# Altium schematic sheet muscle_prot.SchDoc
size A4; PageSetup: Record=PageOptions|CenterHorizontal=True|CenterVertical=True|PrintScale=3.08|XCorrection=1.00|YCorrection=1.00|PrintKind=0|BorderSize=5000000|LeftOffset=0|BottomOffset=0|Orientation=2|PaperLength=1000|PaperWidth=1000|Scale=100|PaperSource=7|PrintQuality=-4|MediaType=1|DitherType=10|PaperKind=A1 (594 x 841 мм)|PrintScaleMode=1
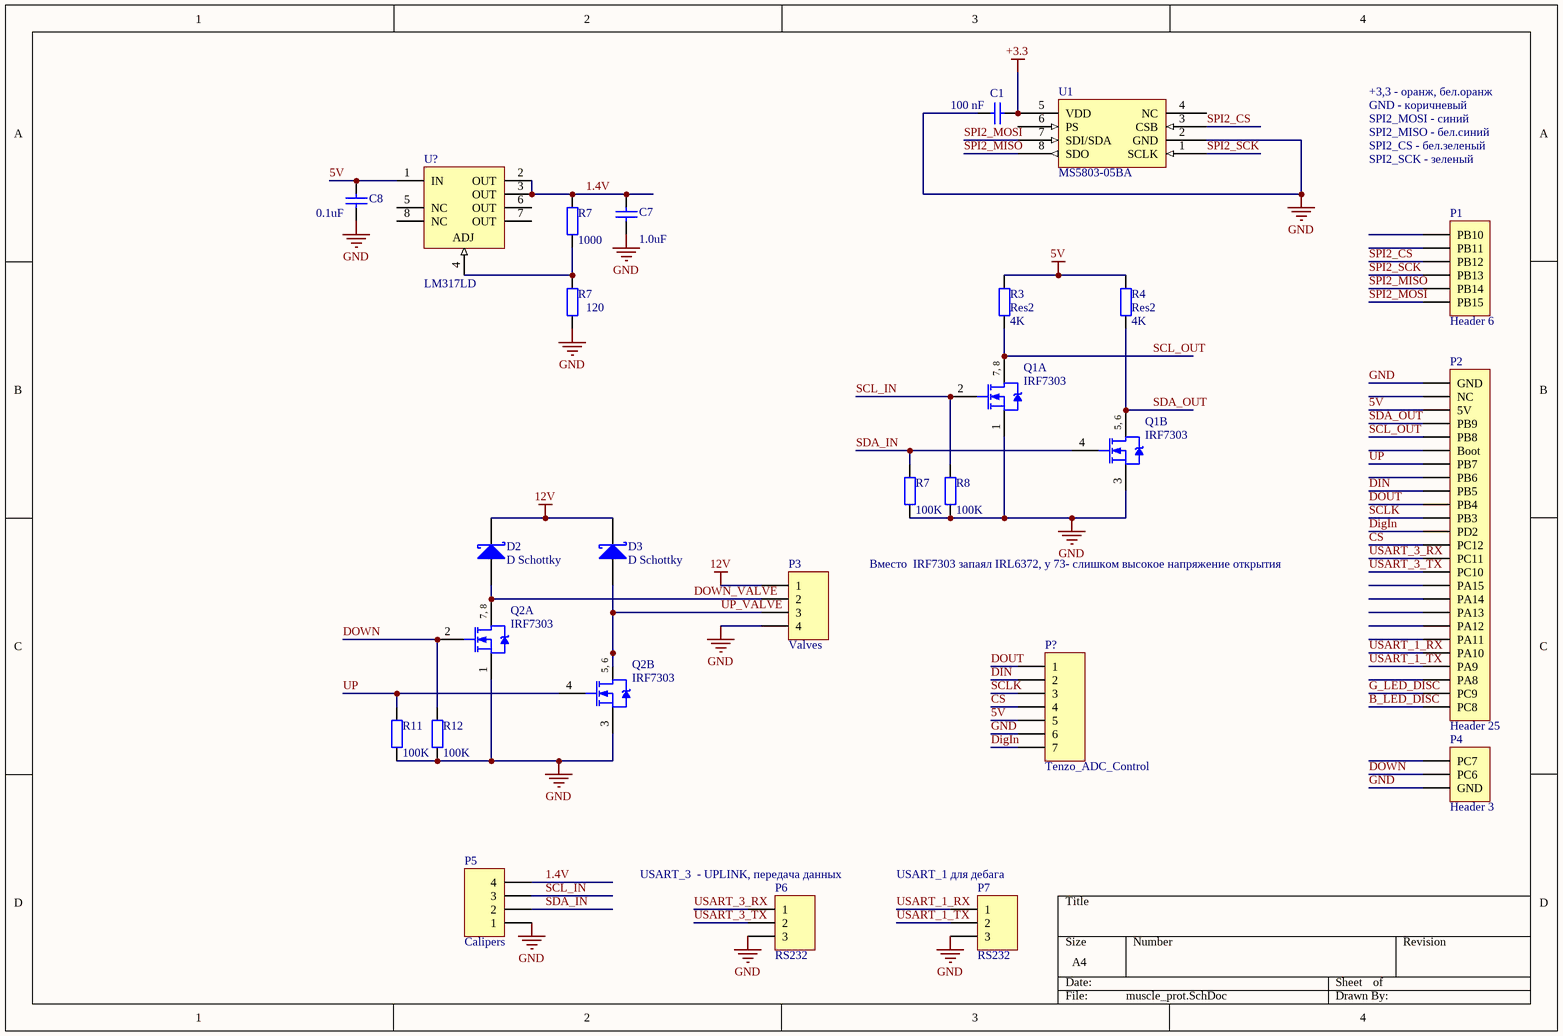
[diagram p0: muscle_prot.SchDoc]

## Parts
(Parts that share a designator on the sheet are numbered #1, #2 ... from top to bottom, then left to right.)
C1  value 100 nF  [1608[0603]]  (hidden comment: Cap Semi)
C7  value 1.0uF  [1608[0603]]  (hidden comment: Cap Semi)
C8  value 0.1uF  [1608[0603]]  (hidden comment: Cap Semi)
D2  D Schottky  [SMB]
D3  D Schottky  [SMB]
P1  Header 6  [HDR1X6]
P2  Header 25  [HDR1X25]
P3  Valves  [HDR1X4]
P4  Header 3  [HDR1X3]
P5  Calipers  [HDR1X4]
P6  RS232  [HDR1X3]
P7  RS232  [HDR1X3]
P?  Tenzo_ADC_Control  [HDR1X7]
Q1  IRF7303  [SO-8_N]  (parts A,B of 2)
Q2  IRF7303  [SO-8_N]  (parts A,B of 2)
R3  Res2  value 4K  [AXIAL-0.4]
R4  Res2  value 4K  [AXIAL-0.4]
R7#1  value 1000  [AXIAL-0.4]  (hidden comment: Res2)
R7#2  value 120  [AXIAL-0.4]  (hidden comment: Res2)
R7#3  value 100K  [AXIAL-0.4]  (hidden comment: Res2)
R8  value 100K  [AXIAL-0.4]  (hidden comment: Res2)
R11  value 100K  [AXIAL-0.4]  (hidden comment: Res2)
R12  value 100K  [AXIAL-0.4]  (hidden comment: Res2)
U1  MS5803-05BA
U?  LM317LD  [751-02_M]

## Nets
5V: C8.2 P2.3(5V) P?.5 R3.2 R4.2 U?.1(IN)
12V: D2.2(K) D3.2(K) P3.1
+3.3: C1.1 U1.5(VDD)
GND: C1.2 C7.1 C8.1 P2.1(GND) P3.4 P4.3(GND) P5.1 P6.3 P7.3 P?.6 Q1.1(S) Q1.3(S) Q2.1(S) Q2.3(S) R7#2.1 R7#3.1 R8.1 R11.1 R12.1 U1.2(GND)
1.4V: C7.2 P5.4 R7#1.2 U?.2(OUT) U?.3(OUT)
B_LED_DISC: P2.25(PC8)
CS: P2.13(PC12) P?.4
DigIn: P2.12(PD2) P?.7
DIN: P2.9(PB5) P?.2
DOUT: P2.10(PB4) P?.1
DOWN: P4.2(PC6) Q2.2(G) R12.2
DOWN_VALVE: D2.1(A) P3.2 Q2.7(D) Q2.8(D)
G_LED_DISC: P2.24(PC9)
SCL_IN: P5.3 Q1.2(G) R8.2
SCL_OUT: P2.5(PB8) Q1.7(D) Q1.8(D) R3.1
SCLK: P2.11(PB3) P?.3
SDA_IN: P5.2 Q1.4(G) R7#3.2
SDA_OUT: P2.4(PB9) Q1.5(D) Q1.6(D) R4.1
SPI2_CS: P1.3(PB12) U1.3(CSB)
SPI2_MISO: P1.5(PB14) U1.8(SDO)
SPI2_MOSI: P1.6(PB15) U1.7(SDI/SDA)
SPI2_SCK: P1.4(PB13) U1.1(SCLK)
UP: P2.7(PB7) Q2.4(G) R11.2
UP_VALVE: D3.1(A) P3.3 Q2.5(D) Q2.6(D)
USART_1_RX: P2.21(PA10) P7.1
USART_1_TX: P2.22(PA9) P7.2
USART_3_RX: P2.14(PC11) P6.1
USART_3_TX: P2.15(PC10) P6.2
NetR7#1_1: R7#1.1 R7#2.2 U?.4(ADJ)

Not connected (* = marked no-connect by the designer): P1 1(PB10) 2(PB11); P2 2(NC) 6(Boot) 8(PB6) 16(PA15) 17(PA14) 18(PA13) 19(PA12) 20(PA11) 23(PA8); P4 1(PC7); U1 4(NC) 6(PS); U? 5(NC) 6(OUT) 7(OUT) 8(NC)

## Notes on the sheet
- +3,3 - оранж, бел.оранж
- GND - коричневый
- SPI2_MOSI - синий
- SPI2_MISO - бел.синий
- SPI2_CS - бел.зеленый
- SPI2_SCK - зеленый
- Вместо  IRF7303 запаял IRL6372, у 73- слишком высокое напряжение открытия
- (near P6) USART_3  - UPLINK, передача данных
- (near P7) USART_1 для дебага
- (in symbol IRF7303, part A) 7, 8
- (in symbol IRF7303, part B) 5, 6

## Library data of the parts
C1 C7 C8 = Cap Semi: Capacitor (Semiconductor SIM Model); Published: 8-Jun-2000; LatestRevisionDate: 29-May-2009; LatestRevisionNote: IPC-7351 Footprint Added.; PackageReference: C1206; Publisher: Altium Limited; PackageDescription: Chip Capacitor
D2 D3 = D Schottky: Schottky Diode; Published: 8-Jun-2000; LatestRevisionDate: 17-Jul-2002; LatestRevisionNote: Re-released for DXP Platform.; PackageReference: SMB; Publisher: Altium Limited; PackageDescription: DO-214-AA/SMB; 2 C-Bend Leads; Body 5.3 x 3.6 mm, inc. leads (LxW); Code_JEDEC: DO-214-AA
P1 = Header 6: Header, 6-Pin; LatestRevisionDate: 17-Jul-2002; LatestRevisionNote: Re-released for DXP Platform.; Publisher: Altium Limited
P2 = Header 25: Header, 25-Pin; LatestRevisionDate: 17-Jul-2002; LatestRevisionNote: Re-released for DXP Platform.; Publisher: Altium Limited
P3 P5 = Header 4: Header, 4-Pin; LatestRevisionDate: 17-Jul-2002; LatestRevisionNote: Re-released for DXP Platform.; Publisher: Altium Limited
P4 P6 P7 = Header 3: Header, 3-Pin; LatestRevisionDate: 17-Jul-2002; LatestRevisionNote: Re-released for DXP Platform.; Publisher: Altium Limited
P? = Header 7: Header, 7-Pin; LatestRevisionDate: 17-Jul-2002; LatestRevisionNote: Re-released for DXP Platform.; Publisher: Altium Limited
Q1 Q2 = IRF7303: HEXFET Power MOSFET; Published: 8-Jun-2000; LatestRevisionDate: 13-Apr-2006; LatestRevisionNote: IPC-7351 Footprint Added.; DatasheetVersion: Aug-1997; PackageVersion: Feb-2001; PackageReference: SO-8; Publisher: Altium Limited; PackageDescription: 8-Pin Plastic Small Outline Integrated Circuit 1.27 mm Pitch; Code_JEDEC: MS-012-AA; Code_IPC: SOIC127P600-8; ComponentLink1Description: Manufacturer Link; ComponentLink1URL: http://www.irf.com/; ComponentLink2Description: Datasheet; ComponentLink2URL: http://www.irf.com/product-info/datasheets/data/irf7303.pdf
R3 R4 R7#1-R7#3 R8 R11 R12 = Res2: Resistor; Published: 8-Jun-2000; LatestRevisionDate: 17-Jul-2002; LatestRevisionNote: Re-released for DXP Platform.; PackageReference: AXIAL-0.4; Publisher: Altium Limited; PackageDescription: Axial Device, Thru-Hole; 2 Leads; 0.4 in Pin Spacing
U1 = MS5803-05BA: Miniature Altimeter
U? = LM317LD: Low Current 3-Terminal Adjustable Positive Voltage Regulator; Published: 17-Jul-2002; LatestRevisionDate: 13-Apr-2006; LatestRevisionNote: IPC-7351 Footprint Added.; DatasheetVersion: 1988; PackageReference: 751-02; Publisher: Altium Limited; PackageDescription: 8-Pin Small Outline Integrated Circuit 1.27 mm Pitch; Code_JEDEC: MS-012-AA; Code_IPC: SOIC127P600-8; ComponentLink1Description: Manufacturer Link; ComponentLink1URL: http://www.onsemi.com/site/products/taxonomy/0,4438,503,00.html; ComponentLink2Description: Datasheet; ComponentLink2URL: http://www.onsemi.com/pub/Collateral/LM317L-D.PDF